# Altium schematic sheet keyboard.SchDoc
size A4
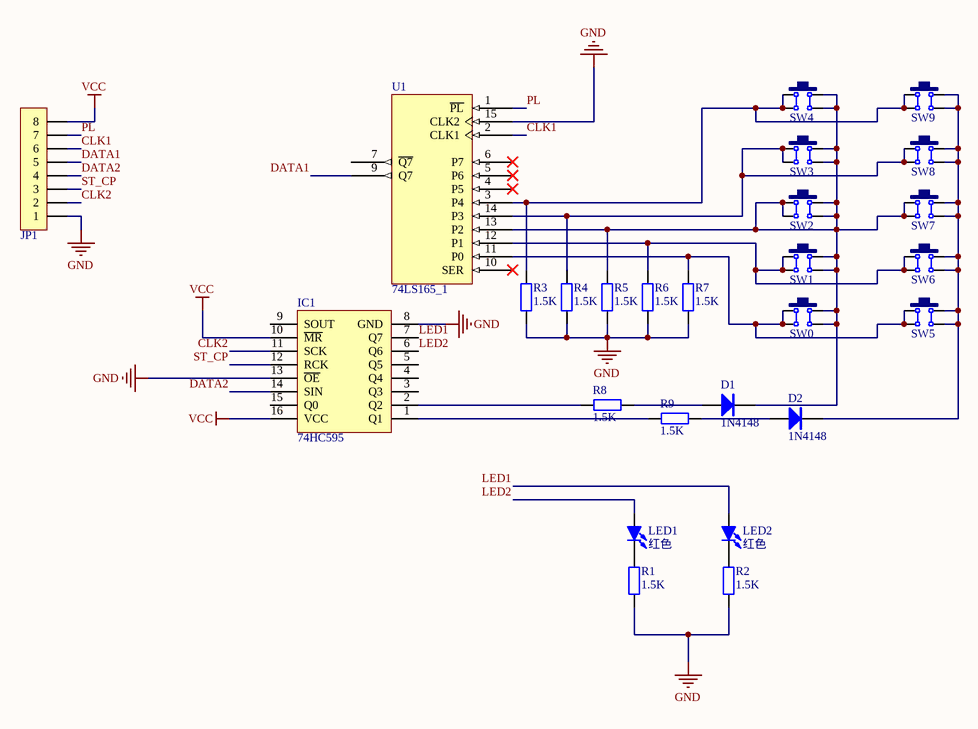
[diagram p0: keyboard.SchDoc]

## Parts
D1  1N4148  [SOD-323]
D2  1N4148  [SOD-323]
IC1  74HC595  [SOP16_N]
JP1  HDR-1X8  [XH2.54-WI-8P]  (value not drawn)
LED1  红色  [LED 0805R]
LED2  红色  [LED 0805R]
R1  1.5K  [R 0805_L]
R2  1.5K  [R 0805_L]
R3  1.5K  [R 0805_L]
R4  1.5K  [R 0805_L]
R5  1.5K  [R 0805_L]
R6  1.5K  [R 0805_L]
R7  1.5K  [R 0805_L]
R8  1.5K  [R 0805_L]
R9  1.5K  [R 0805_L]
SW0  12x12x5  [TSW SMD-12*12*4.3]  (value not drawn)
SW1  12x12x5  [TSW SMD-12*12*4.3]  (value not drawn)
SW2  12x12x5  [TSW SMD-12*12*4.3]  (value not drawn)
SW3  12x12x5  [TSW SMD-12*12*4.3]  (value not drawn)
SW4  12x12x5  [TSW SMD-12*12*4.3]  (value not drawn)
SW5  12x12x5  [TSW SMD-12*12*4.3]  (value not drawn)
SW6  12x12x5  [TSW SMD-12*12*4.3]  (value not drawn)
SW7  12x12x5  [TSW SMD-12*12*4.3]  (value not drawn)
SW8  12x12x5  [TSW SMD-12*12*4.3]  (value not drawn)
SW9  12x12x5  [TSW SMD-12*12*4.3]  (value not drawn)
U1  74LS165_1  [SOP16_M]

## Nets
GND: IC1.8(GND) IC1.13(~{OE}) JP1.1 R1.2 R2.2 R3.2 R4.2 R5.2 R6.2 R7.2 U1.8(GND) U1.15(CLK2)
VCC: IC1.10(~{MR}) IC1.16(VCC) JP1.8 U1.16(VCC)
CLK1: JP1.6 U1.2(CLK1)
CLK2: IC1.11(SCK) JP1.2
DATA1: JP1.5 U1.9(Q7)
DATA2: IC1.14(SIN) JP1.4
LED1: IC1.7(Q7) LED2.1(A)
LED2: IC1.6(Q6) LED1.1(A)
PL: JP1.7 U1.1(~{PL})
ST_CP: IC1.12(RCK) JP1.3
NetD1_1: D1.1(A) R8.2
NetD1_2: D1.2(K) R5.1 SW0.2 SW0.3 SW1.2 SW1.3 SW2.1 SW2.2 SW2.3 SW2.4 SW3.2 SW3.3 SW4.2 SW4.3 SW7.1 SW7.4 U1.13(P2)
NetD2_1: D2.1(A) R9.2
NetD2_2: D2.2(K) SW5.2 SW5.3 SW6.2 SW6.3 SW7.2 SW7.3 SW8.2 SW8.3 SW9.2 SW9.3
NetIC1_1: IC1.1(Q1) R9.1
NetIC1_2: IC1.2(Q2) R8.1
NetLED1_2: LED1.2(K) R1.1
NetLED2_2: LED2.2(K) R2.1
NetR3_1: R3.1 SW4.1 SW4.4 SW9.1 SW9.4 U1.3(P4)
NetR4_1: R4.1 SW3.1 SW3.4 SW8.1 SW8.4 U1.14(P3)
NetR6_1: R6.1 SW1.1 SW1.4 SW6.1 SW6.4 U1.12(P1)
NetR7_1: R7.1 SW0.1 SW0.4 SW5.1 SW5.4 U1.11(P0)

Not connected (* = marked no-connect by the designer): IC1 3(Q3) 4(Q4) 5(Q5) 9(SOUT) 15(Q0); U1 4(P5)* 5(P6)* 6(P7)* 7(~{Q7}) 10(SER)*

## Library data of the parts
D1 D2 = 1N4148: 高速开关二极管; 版权归属: 源创客; BOM名称: 高速开关二极管; 学习资源: www.ooocke.com
IC1 = 74HC595: 8位移位寄存器; 版权归属: 源创客; BOM名称: 8位移位寄存器; 学习资源: www.ooocke.com
JP1 = Header 8: 8P接插件; 版权归属: 源创客; BOM名称: 8P接插件; 学习资源: www.ooocke.com
LED1 LED2 = LED-3MM: 插件LED; 版权归属: 源创客; BOM名称: 插件LED; 学习资源: www.ooocke.com
R1-R9 = R: 贴片电阻; 版权归属: 源创客; BOM名称: 贴片电阻; 学习资源: www.ooocke.com
SW0-SW9 = TSW SMD-12x12: 贴片12x12轻触开关; 版权归属: 源创客; BOM名称: 贴片12x12轻触开关; 学习资源: www.ooocke.com